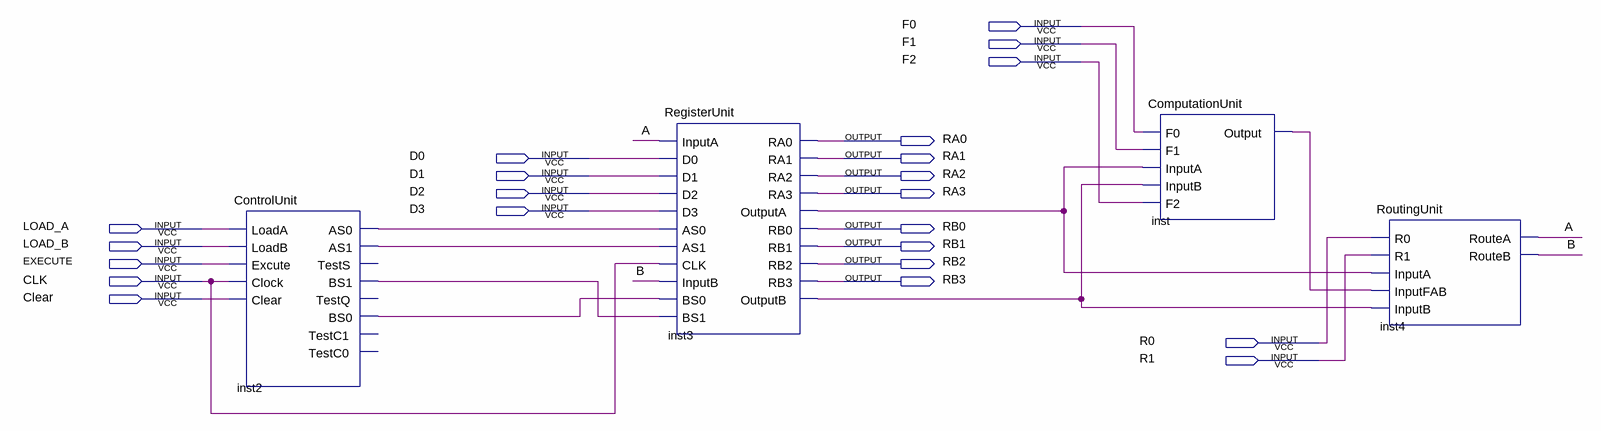
[diagram p0: schematic sheet]
// Quartus schematic lab3.bdf as structural Verilog: 4 symbols, 22 pins
module lab3 (
  input  F0,
  input  F1,
  input  F2,
  input  D0,
  input  D1,
  input  D2,
  input  D3,
  input  LOAD_A,
  input  LOAD_B,
  input  EXECUTE,
  input  CLK,
  input  Clear,
  input  R0,
  input  R1,
  output RA0,
  output RA1,
  output RA2,
  output RA3,
  output RB0,
  output RB1,
  output RB2,
  output RB3
);

  wire A, B, inst2_as0, inst2_as1, inst2_bs0, inst2_bs1, inst3_outputa, inst3_outputb, inst_output;

  ControlUnit inst2 (
    .LoadA(LOAD_A), .LoadB(LOAD_B), .Excute(EXECUTE), .Clock(CLK), .Clear(Clear), .AS0(inst2_as0),
    .AS1(inst2_as1), .BS1(inst2_bs1), .BS0(inst2_bs0));  // open: TestS, TestQ, TestC1, TestC0
  RegisterUnit inst3 (
    .InputA(A), .D0(D0), .D1(D1), .D2(D2), .D3(D3), .AS0(inst2_as0), .AS1(inst2_as1), .CLK(CLK), .InputB(B),
    .BS0(inst2_bs0), .BS1(inst2_bs1), .RA0(RA0), .RA1(RA1), .RA2(RA2), .RA3(RA3), .OutputA(inst3_outputa),
    .RB0(RB0), .RB1(RB1), .RB2(RB2), .RB3(RB3), .OutputB(inst3_outputb));
  ComputationUnit inst (
    .F0(F0), .F1(F1), .InputA(inst3_outputa), .InputB(inst3_outputb), .F2(F2), .Output(inst_output));
  RoutingUnit inst4 (
    .R0(R0), .R1(R1), .InputA(inst3_outputa), .InputFAB(inst_output), .InputB(inst3_outputb), .RouteA(A),
    .RouteB(B));
endmodule
